# EAGLE design maze_poke_1_0 (EAGLE 6.6.0)
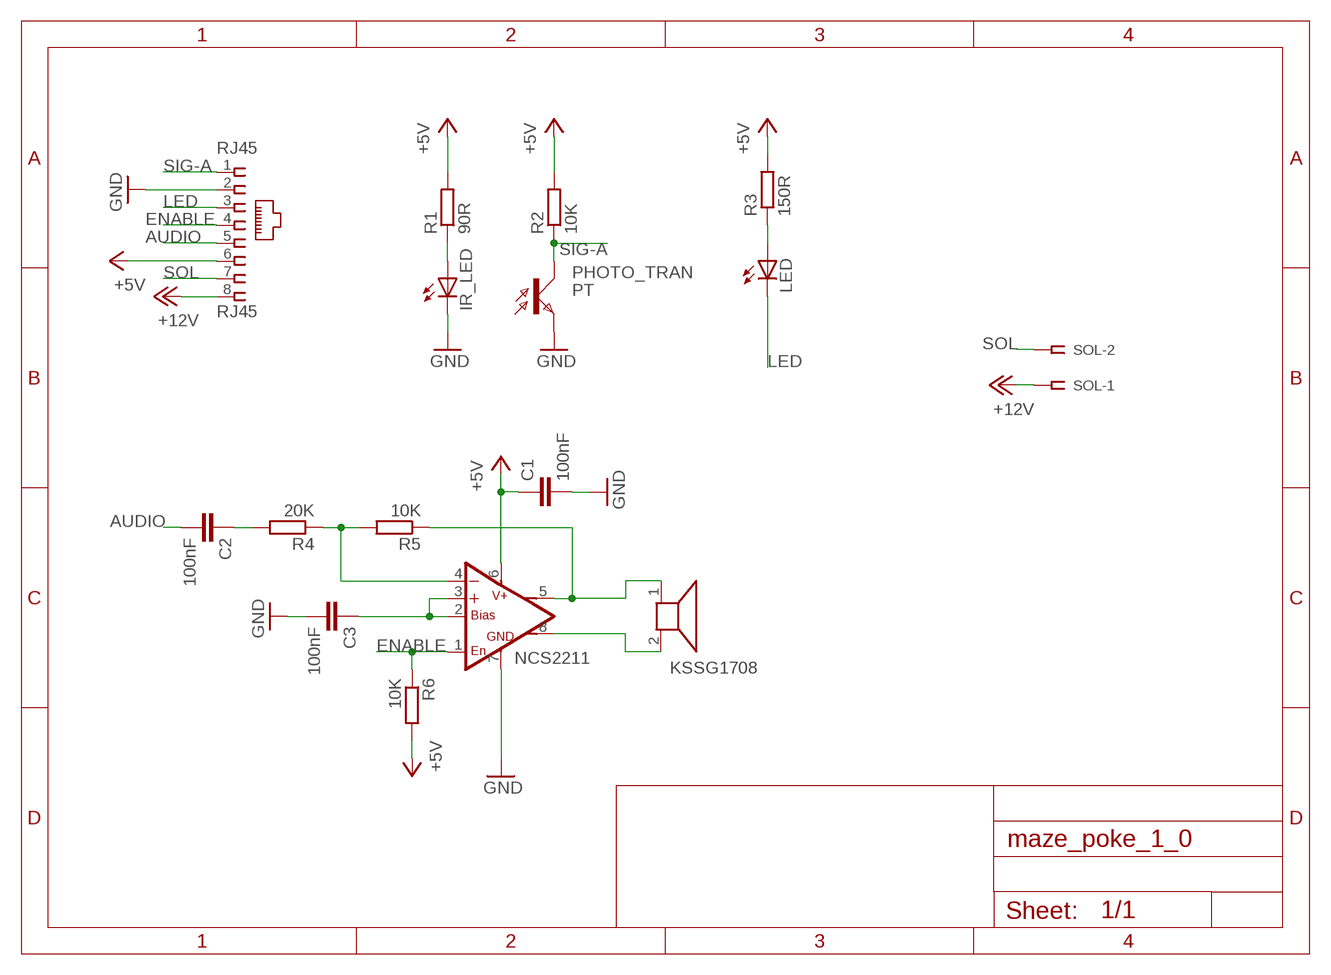
[diagram p0: schematic, sheet 1]

## Parts
C1  100nF  C-EUC0805  [C0805]
C2  100nF  C-EUC0805  [C0805]
C3  100nF  C-EUC0805  [C0805]
IR_LED  LEDIRL80A  [IRL80A]
LED  LEDSML0805  [SML0805]
NCS2211  NCS22111M  [SO08]
PHOTO_TRAN  PT  LPT80A  [LPT80A]
R1  90R  R-EU_R0805  [R0805]
R2  10K  R-EU_M0805  [M0805]
R3  150R  R-EU_M0805  [M0805]
R4  20K  R-EU_M0805  [M0805]
R5  10K  R-EU_M0805  [M0805]
R6  10K  R-EU_M0805  [M0805]
RJ45  RJ45  RJ45VERTICAL  [RJ45-NO-SHIELD-VERTICAL]
SOL  SSW-102-02-S-S-RA  [SSW-102-02-S-S-RA]
U$1  KSSG1708  [KSSG1708]

## Nets
+5V: C1.1 NCS2211.6(VS) R1.2 R2.2 R3.2 R6.2 RJ45.6
+12V: RJ45.8 SOL.1
AMP_REF: C3.1 NCS2211.2(BIAS) NCS2211.3(+IN)
AUDIO: C2.2 RJ45.5
ENABLE: NCS2211.1(ENABLE) R6.1 RJ45.4
GND: C1.2 C3.2 IR_LED.K(C) NCS2211.7(GND) PHOTO_TRAN.E RJ45.2
LED: LED.C RJ45.3
N$1: IR_LED.A R1.1
N$3: C2.1 R4.2
N$10: LED.A R3.1
SIG3: NCS2211.4(-IN) R4.1 R5.2
SIG-A: PHOTO_TRAN.C R2.1 RJ45.1
SOL: RJ45.7 SOL.2
SPEAKER+: NCS2211.5(+OUT) R5.1 U$1.1
SPEAKER-: NCS2211.8(-OUT) U$1.2

## Library data of the parts
C1-C3 = rcl:C-EU: CAPACITOR, European symbol
IR_LED LED = led:LED: LED OSRAM: - CHIPLED LG R971, LG N971, LY N971, LG Q971, LY Q971, LO R971, LY R971 LH N974, LH R974 LS Q976, LO Q976, LY Q976 LO Q996 - Hyper CHIPLED LW Q18S LB Q993, LB Q99A, LB R99A - SideLED LS A670, LO A670, LY A670, LG A670, LP A670 LB A673, LV A673, LT A673, LW A673 LH A674 LY A675 LS A676, LA A676, LO A676, LY A676, LW A676 LS A679, LY A679, LG A679 - Hyper Micro SIDELED® LS Y876, LA Y876, LO Y876, LY Y876 LT Y87S - SmartLED LW L88C, LW L88S LB L89C, LB L89S, LG L890 LS L89K, LO L89K, LY L89K LS L896, LA L896, LO L896, LY L896 - TOPLED LS T670, LO T670, LY T670, LG T670, LP T670 LSG T670, LSP T670, LSY T670, LOP T670, LYG T670 LG T671, LOG T671, LSG T671 LB T673, LV T673, LT T673, LW T673 LH T674 LS T676, LA T676, LO T676, LY T676, LB T676, LH T676, LSB T676, LW T676 LB T67C, LV T67C, LT T67C, LS T67K, LO T67K, LY T67K, LW E67C LS E67B, LA E67B, LO E67B, LY E67B, LB E67C, LV E67C, LT E67C LW T67C LS T679, LY T679, LG T679 LS T770, LO T770, LY T770, LG T770, LP T770 LB T773, LV T773, LT T773, LW T773 LH T774 LS E675, LA E675, LY E675, LS T675 LS T776, LA T776, LO T776, LY T776, LB T776 LHGB T686 LT T68C, LB T68C - Hyper Mini TOPLED® LB M676 - Mini TOPLED Santana® LG M470 LS M47K, LO M47K, LY M47K Source: http://www.osram.convergy.de LUXEON: - LUMILED® LXK2-PW12-R00, LXK2-PW12-S00, LXK2-PW14-U00, LXK2-PW14-V00 LXK2-PM12-R00, LXK2-PM12-S00, LXK2-PM14-U00 LXK2-PE12-Q00, LXK2-PE12-R00, LXK2-PE12-S00, LXK2-PE14-T00, LXK2-PE14-U00 LXK2-PB12-K00, LXK2-PB12-L00, LXK2-PB12-M00, LXK2-PB14-N00, LXK2-PB14-P00, LXK2-PB14-Q00 LXK2-PR12-L00, LXK2-PR12-M00, LXK2-PR14-Q00, LXK2-PR14-R00 LXK2-PD12-Q00, LXK2-PD12-R00, LXK2-PD12-S00 LXK2-PH12-R00, LXK2-PH12-S00 LXK2-PL12-P00, LXK2-PL12-Q00, LXK2-PL12-R00 Source: www.luxeon.com KINGBRIGHT: KA-3528ASYC Source: www.kingbright.com
NCS2211 = NCS2211:NCS2211: Low Voltage Audio Power Amplifier Source: http://cache.national.com/ds/LM/LM386.pdf
PHOTO_TRAN = opto-trans-siemens:LPT80A: PHOTO TRANSISTOR; OC_FARNELL: unknown; OC_NEWARK: unknown
R1-R6 = resistor:R-EU_: RESISTOR, European symbol
RJ45 = con-tycoelectronics-vertical_RJ45:RJ45: CORCOM Modular RJ Jacks No Shield Source: www.tycoelectronics.com .. ENG_DS_1654001_1099_RJ_L_0507.pdf
SOL = con-samtec:SSW-102-02-S-S: THROUGH-HOLE .025" SQ POST SOCKET Source: Samtec SSW.pdf; MPN: SSW-102-02-S-S-RA; OC_FARNELL: unknown; OC_NEWARK: 11P9352
U$1 = buzzer:KSSG1708

## Board
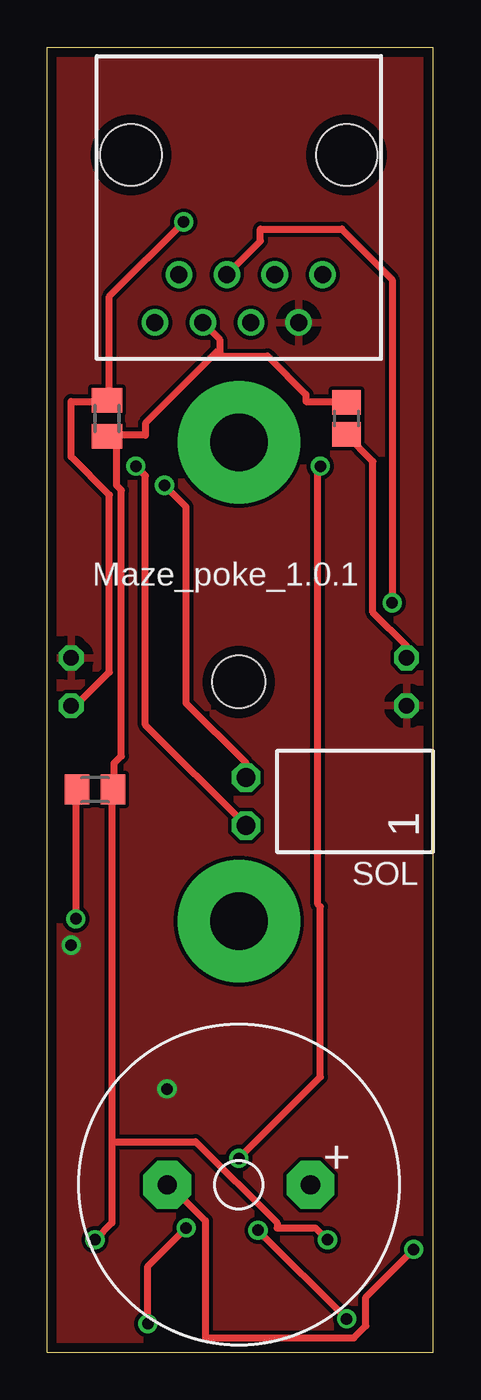
[diagram p1: board, top side]
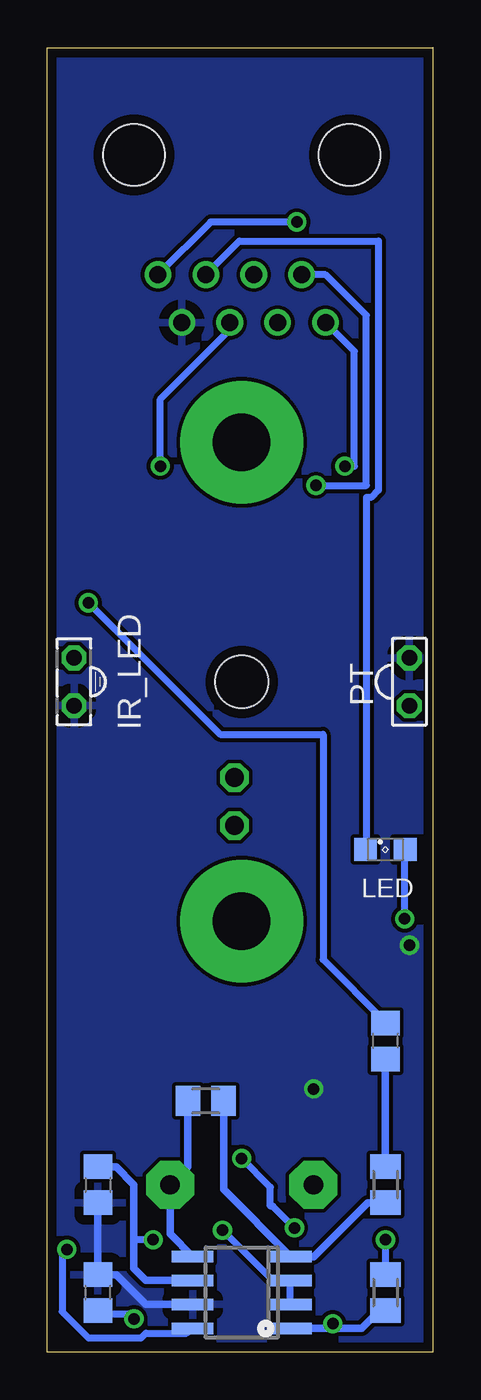
[diagram p2: board, bottom side, seen from below]

Size 20.48 x 69.22 mm. Coordinates in mm from the lower left corner, seen from the top.
Outline: 0,69.18 20.48,69.18 20.48,0 0,0 0,69.22
Copper layers (1*16): Top 0.035mm / dielectric 1.5mm / Bottom 0.035mm
Design rules "default *": minimum track width 15mil, minimum drill 24mil, track to track 8mil, track to pad 8mil, pad to pad 8mil, via to via 8mil, smd to smd 8mil, copper to edge 20mil, drill to drill 8mil, minimum pad ring 10mil, minimum via ring 8mil, stop-mask expansion 4mil, vias tented up to drill 0mil, thermal gap 20mil
Holes 2.8 mm at 10.16,35.56
vRestrict: area 6.3,0 to 14,5.7

### Footprints (pad centres in the part's own frame; a part is rotated, then mirrored left to right if it is on the bottom)
C0805 = smd 1.3 x 1.5: 1 -0.95,0; 2 0.95,0
IRL80A = drill 0.813 octagon: A 0,-1.27; K 0,1.27
SML0805 = smd 1.2 x 1.2: A 1.05,0; C -1.05,0
SO08 = smd 0.6 x 2.2: 1 -1.905,-2.6; 2 -0.635,-2.6; 3 0.635,-2.6; 4 1.905,-2.6; 5 1.905,2.6; 6 0.635,2.6; 7 -0.635,2.6; 8 -1.905,2.6
LPT80A = drill 0.813 octagon: C 0,-1.27; E 0,1.27
R0805 = smd 1.3 x 1.5: 1 -0.85,0; 2 0.85,0
M0805 = smd 1.3 x 1.6: 1 -0.95,0; 2 0.95,0
RJ45-NO-SHIELD-VERTICAL = drill 0.9 pad 1.4: 1 -4.445,5.08; 2 -3.175,7.62; 3 -1.905,5.08; 4 -0.635,7.62; 5 0.635,5.08; 6 1.905,7.62; 7 3.175,5.08; 8 4.445,7.62 | hole 3.251: -5.715,-1.27; 5.715,-1.27
SSW-102-02-S-S-RA = drill 1 pad 1.5 octagon: 1 -1.27,1.524; 2 1.27,1.524
KSSG1708 = drill 1.016 pad 2.54 octagon: 1 -3.8,0; 2 3.8,0

### Placement (x,y rotation side)
C1  17.78,8.89 270 bottom
C2  2.54,16.51 90 bottom
C3  17.78,3.17 90 bottom
IR_LED  19.05,35.56 180 bottom
LED  2.54,26.67 0 bottom
NCS2211  10.16,3.17 90 bottom
PHOTO_TRAN  1.27,35.56 0 bottom
R1  15.88,49.53 90 top
R2  3.17,49.53 270 top
R3  2.54,29.84 0 top
R4  2.54,8.89 90 bottom
R5  12.06,13.34 0 bottom
R6  2.54,3.17 90 bottom
RJ45  10.16,62.23 180 top
SOL  12.06,29.21 90 top
U$1  10.16,8.89 180 top

### Tracks (layer width: path | path; a pad name or v marks a point on that pad's centre or on a via)
+5V  (via drill 0.61)
  Top 0.381: 9.14,53.09 9.14,53.72 RJ45.6 | 9.14,53.09 9.14,52.83 11.68,52.83 13.72,50.8 13.72,50.42 15.88,50.42 R1.2 | 9.14,53.09 9.02,53.09 5.21,49.28 5.21,48.64 3.17,48.64 R2.2 3.68,48.51 3.68,45.97 3.94,45.72 3.94,31.62 3.56,31.24 3.56,29.97 R3.2 3.43,29.84 3.43,11.18 | v2.54,5.97 3.43,6.86 3.43,11.18 | v14.86,5.97 14.22,6.6 12.19,6.6 12.19,6.86 7.87,11.18 3.43,11.18
  Bottom 0.381: v2.54,5.97 R6.2 | v14.86,5.97 15.88,5.97
  Bottom 0.406: C1.1 16.82,9.84 15.88,8.89 15.88,5.97 15.88,4.45 15.24,3.81 NCS2211.6
+12V  (via drill 0.61)
  Top 0.381: v4.7,46.99 5.21,46.48 5.21,33.27 SOL.1
  Bottom 0.381: RJ45.8 4.19,53.09 4.19,46.99 v4.7,46.99
AMP_REF  (via drill 0.61)
  Top 0.381: v11.18,6.48 v15.88,1.78
  Bottom 0.381: v15.88,1.78 16.13,2.03 17.65,2.03 17.78,2.16 C3.1 | v11.18,6.48 8.51,3.81 NCS2211.3 7.62,3.68 7.62,2.54 NCS2211.2
AUDIO  (via drill 0.61)
  Top 0.381: v18.29,39.75 18.29,56.9 15.62,59.56 11.3,59.56 11.3,58.93 RJ45.5
  Bottom 0.381: v18.29,39.75 11.3,32.77 5.84,32.77 5.84,20.83 2.54,17.53 C2.2
ENABLE  (via drill 0.61)
  Top 0.381: v14.48,46.99 14.35,46.86 14.35,23.75 14.48,23.62 14.48,14.61 v10.16,10.29 | v7.37,6.6 5.33,4.57 v5.33,1.52
  Bottom 0.381: RJ45.4 10.79,54.1 10.92,54.1 14.48,50.55 v14.48,46.99 | v10.16,10.29 8.64,8.76 8.64,7.75 8.51,7.75 v7.37,6.6 | v5.33,1.52 5.33,1.27
  Bottom 0.406: R6.1 2.85,2.23 3.81,1.27 5.33,1.27 NCS2211.1
GND  (via drill 0.61)
  Bottom 0.406: C1.2 C3.2 16.82,4.12 15.24,2.54 NCS2211.7
  other vias: 6.35,13.97 1.27,21.59
  pour Bottom: 0,0 0,68.58 20.32,68.58 20.32,0
  pour Top: 0,68.58 20.32,68.58 20.32,0 0,0
LED
  Bottom 0.381: RJ45.3 10.29,58.93 2.92,58.93 2.92,45.72 3.3,45.34 3.56,45.34 3.56,26.67 LED.C
N$1
  Top 0.381: IR_LED.A 19.05,37.47 17.27,39.24 17.27,47.24 15.88,48.64 R1.1
N$3
  Bottom 0.406: R4.2 C2.1
N$4  (via drill 3.05 pad 6.5)
  other vias: 10.16,22.86
N$5  (via drill 3.05 pad 6.5)
  other vias: 10.16,48.26
N$10  (via drill 0.61)
  Top 0.381: v1.52,22.99 1.52,29.84 R3.1
  Bottom 0.381: v1.52,22.99 1.52,26.67 LED.A
SIG3
  Bottom 0.406: R5.2 11.12,8.63 NCS2211.4 6.35,5.08 3.49,7.94 R4.1
SIG-A  (via drill 0.61)
  Top 0.381: PHOTO_TRAN.C 1.52,34.29 3.3,36.07 3.3,45.47 1.27,47.5 1.27,50.42 3.17,50.42 R2.1 3.3,50.55 3.3,56.01 v7.24,59.94
  Bottom 0.381: RJ45.1 11.81,59.94 v7.24,59.94
SOL  (via drill 0.61)
  Top 0.381: v6.22,45.97 7.37,44.83 7.37,34.42 10.54,31.24 SOL.2
  Bottom 0.381: RJ45.7 5.71,57.15 3.56,54.99 3.56,45.97 v6.22,45.97
SPEAKER+
  Bottom 0.406: R5.1 13.02,9.84 U$1.1 13.96,6.28 NCS2211.5
SPEAKER-  (via drill 0.61)
  Top 0.381: v19.43,5.46 16.89,2.92 16.89,1.4 16.26,0.76 8.38,0.76 8.38,6.99 6.48,8.89 U$1.2
  Bottom 0.381: v19.43,5.46 19.68,5.21 19.68,2.16 18.29,0.76 15.49,0.76 15.24,1.02 13.08,1.02 12.83,1.27 NCS2211.8

### Text on the board
tPlace: Maze_poke_1.0.1 | +